# EAGLE design TA-1042-8P8C_V5 (EAGLE 9.6.2)
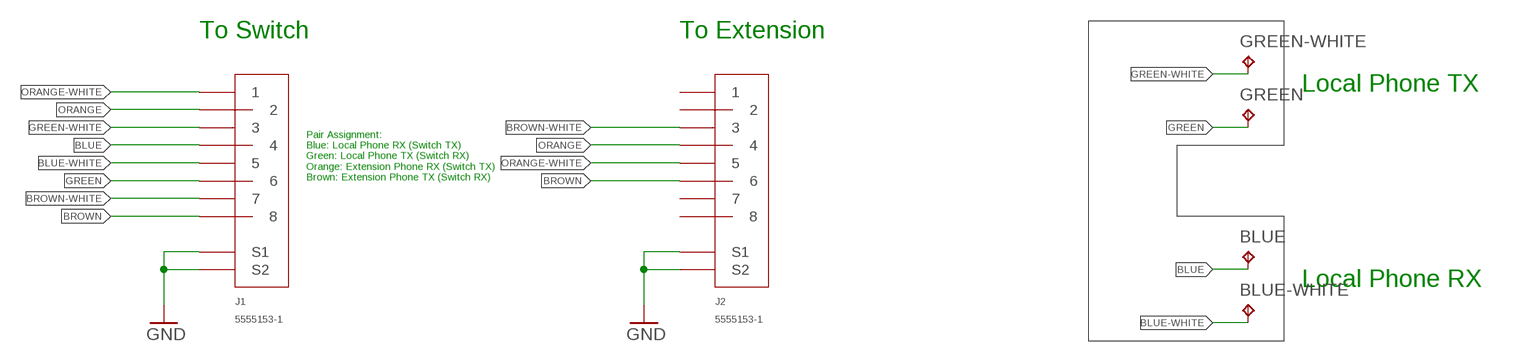
[diagram p0: schematic, sheet 1]

## Parts
BLUE  TPTP20R  [TP20R]
BLUE-WHITE  TPTP20R  [TP20R]
GREEN  TPTP20R  [TP20R]
GREEN-WHITE  TPTP20R  [TP20R]
J1  5555153-1  [5555153-1]
J2  5555153-1  [5555153-1]

## Nets
BLUE: BLUE.TP J1.4
BLUE-WHITE: BLUE-WHITE.TP J1.5
BROWN: J1.8 J2.6
BROWN-WHITE: J1.7 J2.3
GND: J1.S1 J1.S2 J2.S1 J2.S2
GREEN: GREEN.TP J1.6
GREEN-WHITE: GREEN-WHITE.TP J1.3
ORANGE: J1.2 J2.4
ORANGE-WHITE: J1.1 J2.5
Unconnected: J2.1 J2.2 J2.7 J2.8

## Notes on the sheet
- To Switch | To Extension
- Local Phone TX
- Pair Assignment:
  Blue: Local Phone RX (Switch TX)
  Green: Local Phone TX (Switch RX)
  Orange: Extension Phone RX (Switch TX)
  Brown: Extension Phone TX (Switch RX)
- Local Phone RX

## Library data of the parts
BLUE BLUE-WHITE GREEN GREEN-WHITE = testpad:TP: Test pad
J1 J2 = ruark2:5555153-1: Jack Modular Connector 8p8c (RJ45, Ethernet) 90° Angle (Right) Shielded Cat3; PARTNO: A31438-ND

## Board
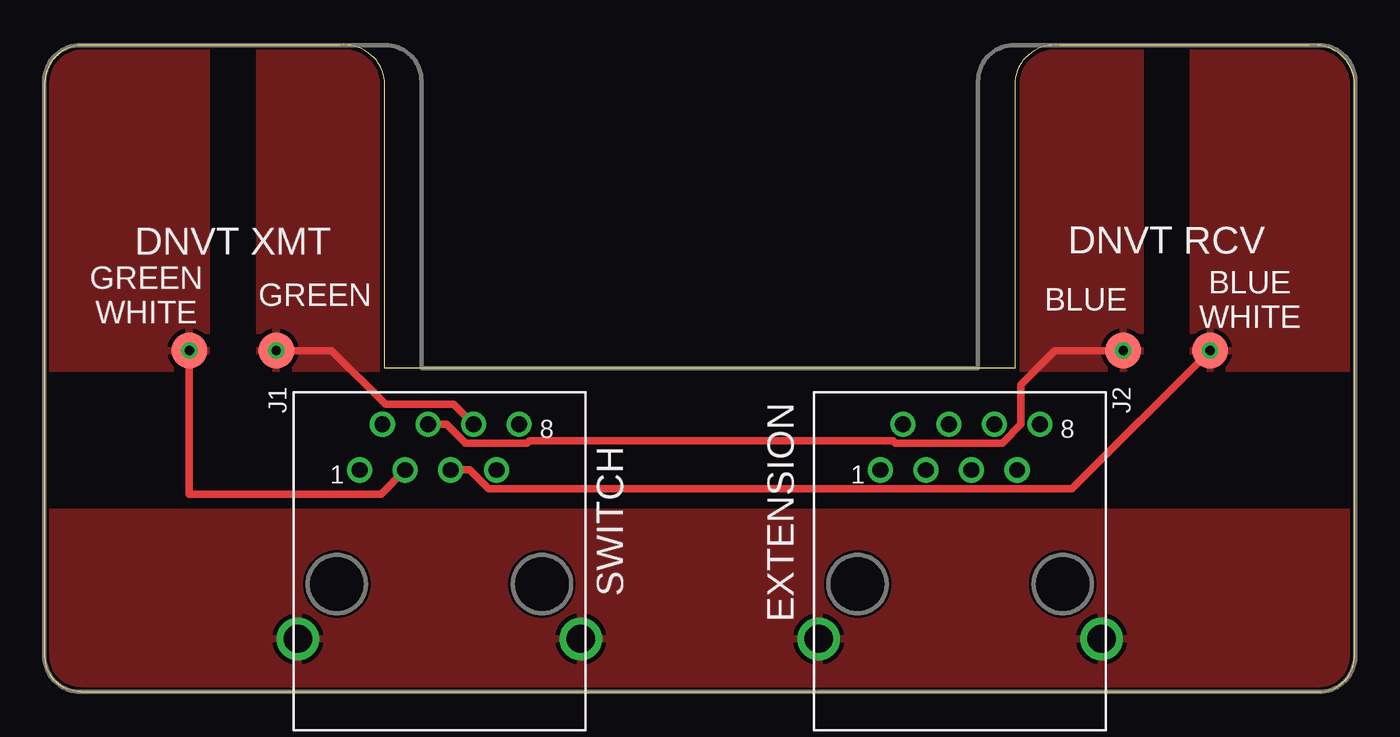
[diagram p1: board, top side]
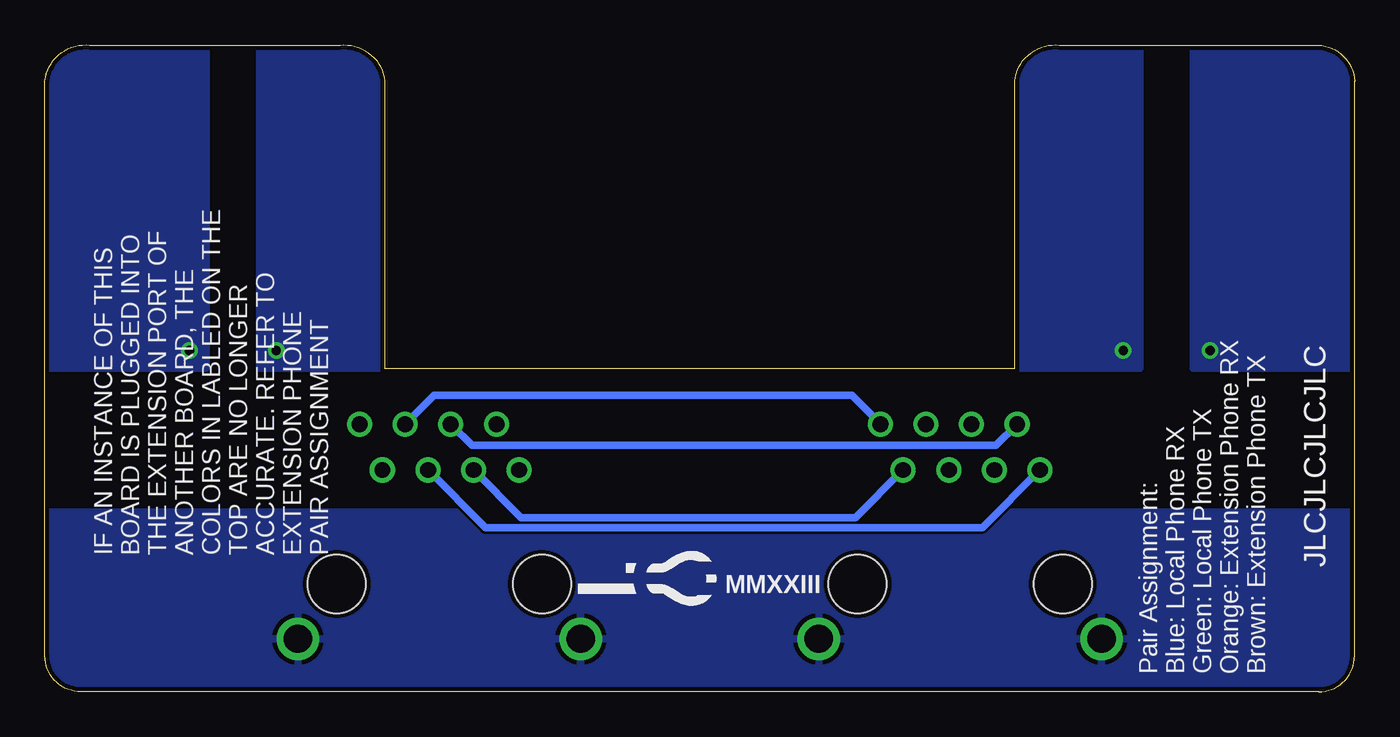
[diagram p2: board, bottom side, seen from below]

Size 72.94 x 36.01 mm. Coordinates in mm from the lower left corner, seen from the top.
Outline: 4.51,0 68.43,0
Outline: 2,0 70.94,0 arc90 72.94,2 72.94,34 arc90 70.43,36 56.51,36 arc90 54.01,34 54.01,18 18.93,18 18.93,34 arc90 16.43,36 2.21,36 arc90 0,34 0,2 arc90 2,0
Copper layers (1*16): Top 0.035mm / dielectric 1.5mm / Bottom 0.035mm
Design rules "default *": minimum track width 6mil, minimum drill 0.35mm, track to track 6mil, track to pad 6mil, pad to pad 6mil, via to via 6mil, smd to smd 6mil, copper to edge 10mil, drill to drill 6mil, minimum pad ring 10mil, minimum via ring 8mil, stop-mask expansion 4mil, vias tented up to drill 0mil, thermal gap 10mil

### Footprints (pad centres in the part's own frame; a part is rotated, then mirrored left to right if it is on the bottom)
TP20R = smd 2 x 2: TP 0,0
5555153-1 = drill 0.889: 1 -4.445,6.35; 2 -3.175,8.89; 3 -1.905,6.35; 4 -0.635,8.89; 5 0.635,6.35; 6 1.905,8.89; 7 3.175,6.35; 8 4.445,8.89 | drill 1.575: S1 -7.874,-3.048; S2 7.874,-3.048 | hole 3.251: -5.715,0; 5.715,0

### Placement (x,y rotation side)
BLUE  60.05,19 90 top
BLUE-WHITE  64.89,19 90 top
GREEN  12.89,19 90 top
GREEN-WHITE  8.05,19 90 top
J1  21.97,6 0 top
J2  50.97,6 0 top

### Tracks (layer width: path | path; a pad name or v marks a point on that pad's centre or on a via)
BLUE  (via drill 0.51)
  Top 0.406: J1.4 22.38,14.89 23.44,13.84 26.85,13.84 26.99,13.98 47.22,13.98 47.36,13.84 53.31,13.84 54.36,14.88 54.36,17.11 56.25,19 BLUE.TP
  other vias: 60.05,19
  pour Top: 50.97,36 50.97,18 60.97,18 60.97,36
  pour Bottom: 50.97,36 50.97,18 60.97,18 60.97,36
BLUE-WHITE  (via drill 0.51)
  Top 0.406: J1.5 23.65,12.35 24.71,11.3 57.18,11.3 BLUE-WHITE.TP
  other vias: 64.89,19
  pour Top: 63.97,36 63.97,18 73.97,18 73.97,36
  pour Bottom: 63.97,36 63.97,18 73.97,18 73.97,36
BROWN
  Bottom 0.406: J2.6 51.25,16.51 27.99,16.51 26.41,14.93 J1.8
BROWN-WHITE
  Bottom 0.406: J2.3 46.42,9.7 27.79,9.7 J1.7
GND
  pour Top: -1.03,0 -1.03,10 73.97,10 73.97,0
  pour Bottom: -1.03,0 -1.03,10 73.97,10 73.97,0
GREEN  (via drill 0.51)
  Top 0.406: J1.6 22.76,16 18.97,16 15.97,19 GREEN.TP
  other vias: 12.89,19
  pour Top: 11.97,36 11.97,18 21.97,18 21.97,36
  pour Bottom: 11.97,36 11.97,18 21.97,18 21.97,36
GREEN-WHITE  (via drill 0.51)
  Top 0.406: J1.3 18.71,11 8.05,11 GREEN-WHITE.TP
  other vias: 8.05,19
  pour Top: -1.03,36 -1.03,18 8.97,18 8.97,36
  pour Bottom: -1.03,36 -1.03,18 8.97,18 8.97,36
ORANGE
  Bottom 0.406: J2.4 49.16,13.72 19.97,13.72 J1.2
ORANGE-WHITE
  Bottom 0.406: J1.1 20.73,9.14 48.4,9.14 J2.5

### Text on the board
tPlace: GREEN / WHITE | GREEN | BLUE | BLUE / WHITE
bPlace: JLCJLCJLCJLC | MMXXIII
tNames: DNVT XMT | DNVT RCV | SWITCH | EXTENSION
bNames: IF AN INSTANCE OF THIS / BOARD IS PLUGGED INTO / THE EXTENSION PORT OF / ANOTHER BOARD, THE / COLORS IN LABLED ON THE / TOP ARE NO LONGER / ACCURATE. REFER TO / EXTENSION PHONE / PAIR ASSIGNMENT | Pair Assignment: / Blue: Local Phone RX / Green: Local Phone TX / Orange: Extension Phone RX / Brown: Extension Phone TX
bStop: 021